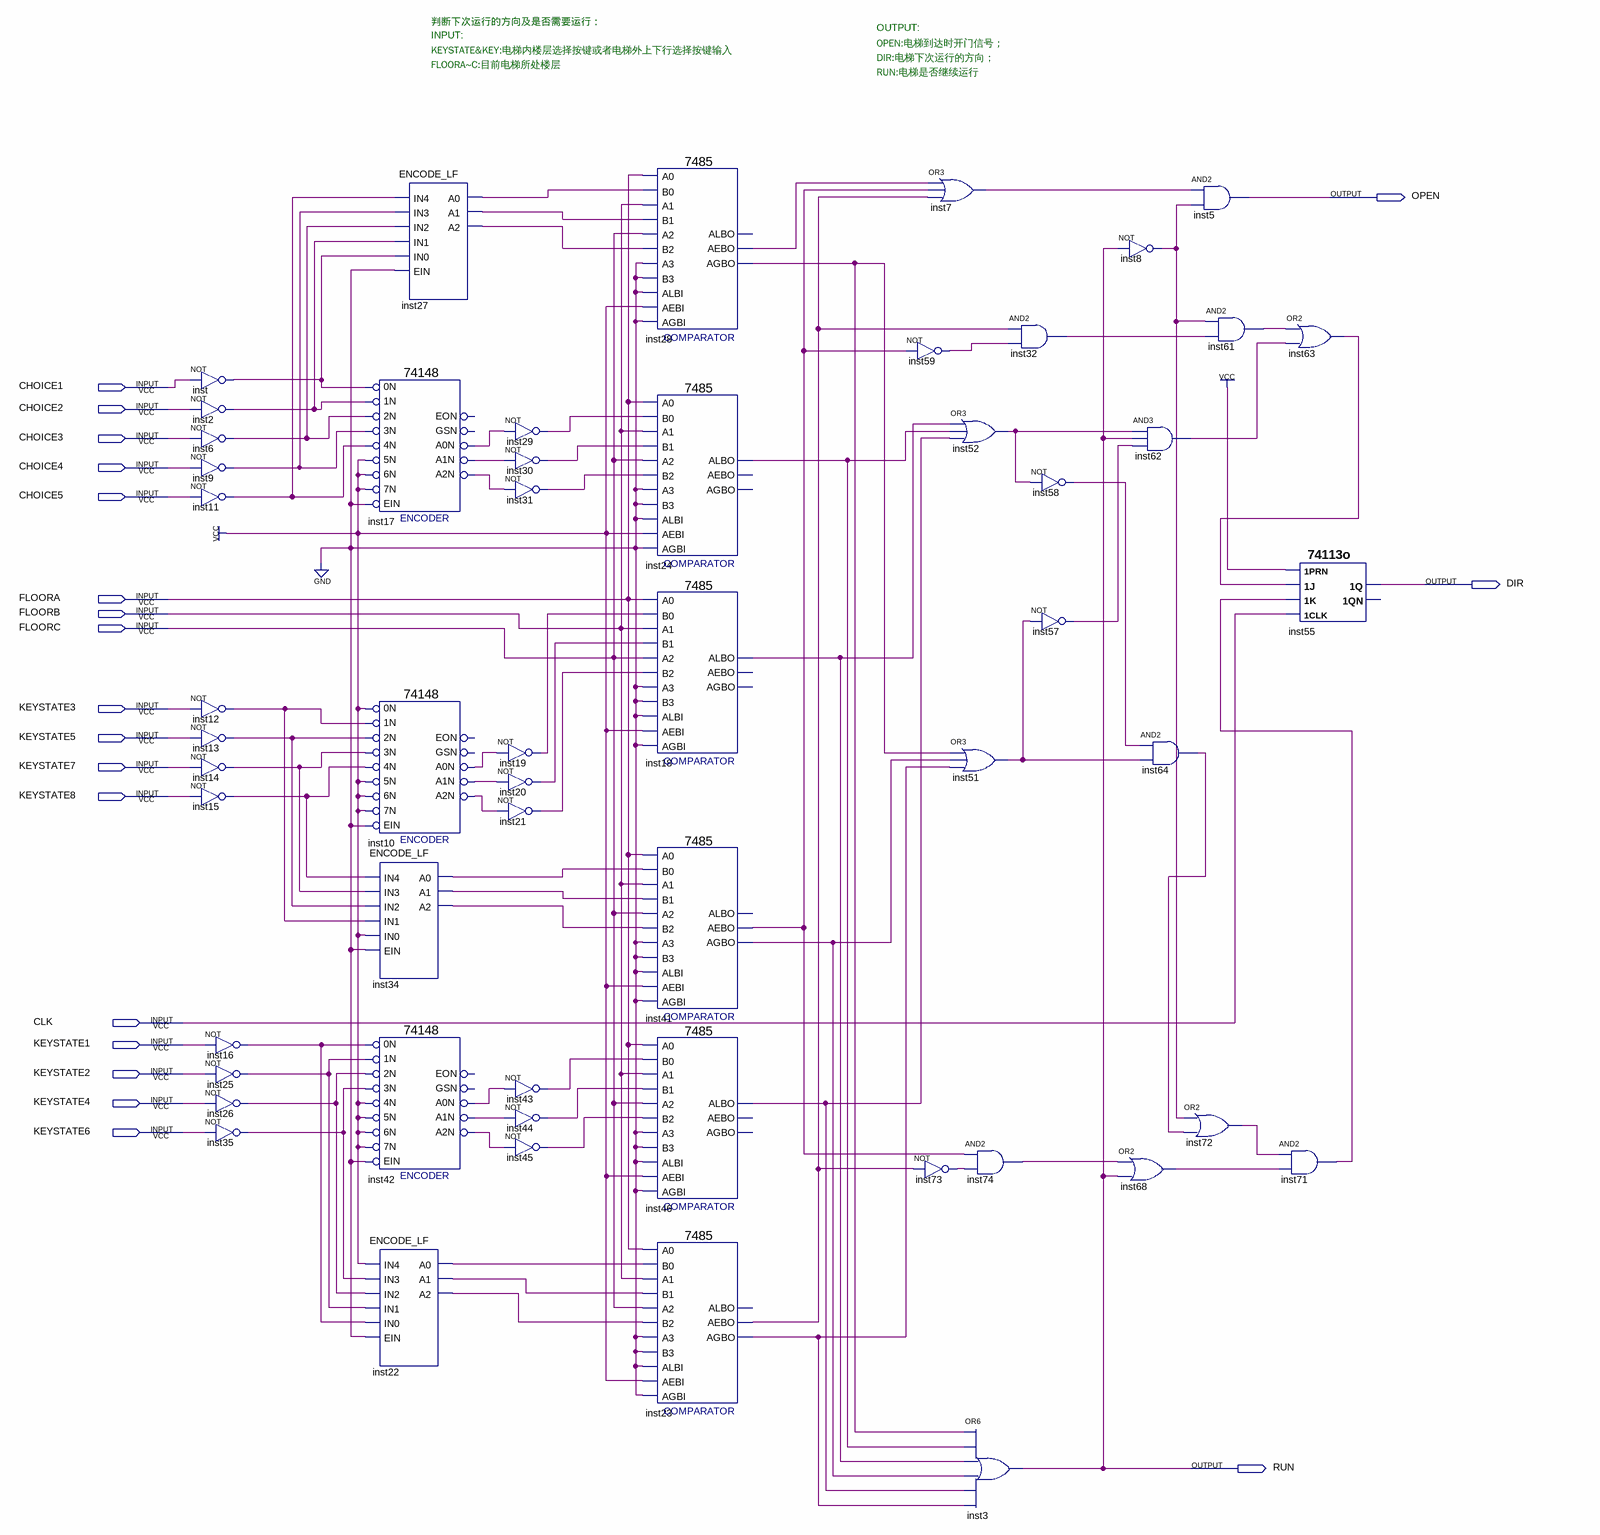
[diagram p0: schematic sheet]
// Quartus schematic nextfloor.bdf as structural Verilog: 54 symbols, 20 pins
module nextfloor (
  input  CHOICE1,
  input  CHOICE2,
  input  CHOICE3,
  input  CHOICE4,
  input  CHOICE5,
  input  FLOORA,
  input  FLOORB,
  input  FLOORC,
  input  KEYSTATE3,
  input  KEYSTATE5,
  input  KEYSTATE7,
  input  KEYSTATE8,
  input  CLK,
  input  KEYSTATE1,
  input  KEYSTATE2,
  input  KEYSTATE4,
  input  KEYSTATE6,
  output OPEN,
  output DIR,
  output RUN
);

  wire inst2_out, inst6_out, inst7_out, inst8_out, inst9_out, inst10_a0n, inst10_a1n, inst10_a2n, inst11_out,
       inst12_out, inst13_out, inst14_out, inst15_out, inst16_out, inst17_a0n, inst17_a1n, inst17_a2n,
       inst18_albo, inst19_out, inst20_out, inst21_out, inst22_a0, inst22_a1, inst22_a2, inst23_aebo,
       inst23_agbo, inst24_albo, inst25_out, inst26_out, inst27_a0, inst27_a1, inst27_a2, inst28_aebo,
       inst28_agbo, inst29_out, inst30_out, inst31_out, inst32_out, inst34_a0, inst34_a1, inst34_a2,
       inst35_out, inst41_aebo, inst41_agbo, inst42_a0n, inst42_a1n, inst42_a2n, inst43_out, inst44_out,
       inst45_out, inst46_albo, inst51_out, inst52_out, inst57_out, inst58_out, inst59_out, inst61_out,
       inst62_out, inst63_out, inst64_out, inst68_out, inst71_out, inst72_out, inst73_out, inst74_out,
       inst_out;

  not inst (inst_out, CHOICE1);
  not inst2 (inst2_out, CHOICE2);
  not inst6 (inst6_out, CHOICE3);
  not inst9 (inst9_out, CHOICE4);
  not inst11 (inst11_out, CHOICE5);
  not inst12 (inst12_out, KEYSTATE3);
  not inst13 (inst13_out, KEYSTATE5);
  not inst14 (inst14_out, KEYSTATE7);
  not inst15 (inst15_out, KEYSTATE8);
  not inst16 (inst16_out, KEYSTATE1);
  not inst25 (inst25_out, KEYSTATE2);
  not inst26 (inst26_out, KEYSTATE4);
  not inst35 (inst35_out, KEYSTATE6);
  ENCODE_LF inst27 (
    .IN4(inst11_out), .IN3(inst9_out), .IN2(inst6_out), .IN1(inst2_out), .IN0(inst_out), .EIN(1'b0),
    .A0(inst27_a0), .A1(inst27_a1), .A2(inst27_a2));
  \74148  inst17 (
    .\5N (1'b1), .\0N (inst_out), .\1N (inst2_out), .\2N (inst6_out), .\3N (inst9_out), .\4N (inst11_out),
    .EIN(1'b0), .\6N (1'b1), .\7N (1'b1), .A1N(inst17_a1n), .A0N(inst17_a0n), .A2N(inst17_a2n));  // open: EON, GSN
  \74148  inst10 (
    .\5N (1'b1), .\0N (1'b1), .\1N (inst12_out), .\2N (inst13_out), .\3N (inst14_out), .\4N (inst15_out),
    .EIN(1'b0), .\6N (1'b1), .\7N (1'b1), .A1N(inst10_a1n), .A0N(inst10_a0n), .A2N(inst10_a2n));  // open: EON, GSN
  ENCODE_LF inst34 (
    .IN4(inst15_out), .IN3(inst14_out), .IN2(inst13_out), .IN1(inst12_out), .IN0(1'b1), .EIN(1'b0),
    .A0(inst34_a0), .A1(inst34_a1), .A2(inst34_a2));
  \74148  inst42 (
    .\5N (1'b1), .\0N (inst16_out), .\1N (inst25_out), .\2N (inst26_out), .\3N (inst35_out), .\4N (1'b1),
    .EIN(1'b0), .\6N (1'b1), .\7N (1'b1), .A1N(inst42_a1n), .A0N(inst42_a0n), .A2N(inst42_a2n));  // open: EON, GSN
  ENCODE_LF inst22 (
    .IN4(1'b1), .IN3(inst35_out), .IN2(inst26_out), .IN1(inst25_out), .IN0(inst16_out), .EIN(1'b0),
    .A0(inst22_a0), .A1(inst22_a1), .A2(inst22_a2));
  not inst29 (inst29_out, inst17_a0n);
  not inst30 (inst30_out, inst17_a1n);
  not inst31 (inst31_out, inst17_a2n);
  not inst19 (inst19_out, inst10_a0n);
  not inst20 (inst20_out, inst10_a1n);
  not inst21 (inst21_out, inst10_a2n);
  not inst43 (inst43_out, inst42_a0n);
  not inst44 (inst44_out, inst42_a1n);
  not inst45 (inst45_out, inst42_a2n);
  \7485  inst28 (
    .A3(1'b0), .B2(inst27_a2), .A2(FLOORC), .AEBI(1'b1), .AGBI(1'b0), .ALBI(1'b0), .A0(FLOORA),
    .B0(inst27_a0), .B3(1'b0), .A1(FLOORB), .B1(inst27_a1), .AGBO(inst28_agbo), .AEBO(inst28_aebo));  // open: ALBO
  \7485  inst24 (
    .A3(1'b0), .B2(inst31_out), .A2(FLOORC), .AEBI(1'b1), .AGBI(1'b0), .ALBI(1'b0), .A0(FLOORA),
    .B0(inst29_out), .B3(1'b0), .A1(FLOORB), .B1(inst30_out), .ALBO(inst24_albo));  // open: AGBO, AEBO
  \7485  inst18 (
    .A3(1'b0), .B2(inst21_out), .A2(FLOORC), .AEBI(1'b1), .AGBI(1'b0), .ALBI(1'b0), .A0(FLOORA),
    .B0(inst19_out), .B3(1'b0), .A1(FLOORB), .B1(inst20_out), .ALBO(inst18_albo));  // open: AGBO, AEBO
  \7485  inst41 (
    .A3(1'b0), .B2(inst34_a2), .A2(FLOORC), .AEBI(1'b1), .AGBI(1'b0), .ALBI(1'b0), .A0(FLOORA),
    .B0(inst34_a0), .B3(1'b0), .A1(FLOORB), .B1(inst34_a1), .AGBO(inst41_agbo), .AEBO(inst41_aebo));  // open: ALBO
  \7485  inst46 (
    .A3(1'b0), .B2(inst45_out), .A2(FLOORC), .AEBI(1'b1), .AGBI(1'b0), .ALBI(1'b0), .A0(FLOORA),
    .B0(inst43_out), .B3(1'b0), .A1(FLOORB), .B1(inst44_out), .ALBO(inst46_albo));  // open: AGBO, AEBO
  \7485  inst23 (
    .A3(1'b0), .B2(inst22_a2), .A2(FLOORC), .AEBI(1'b1), .AGBI(1'b0), .ALBI(1'b0), .A0(FLOORA),
    .B0(inst22_a0), .B3(1'b0), .A1(FLOORB), .B1(inst22_a1), .AGBO(inst23_agbo), .AEBO(inst23_aebo));  // open: ALBO
  or inst7 (inst7_out, inst28_aebo, inst41_aebo, inst23_aebo);
  not inst59 (inst59_out, inst41_aebo);
  not inst73 (inst73_out, inst23_aebo);
  or inst52 (inst52_out, inst18_albo, inst24_albo, inst46_albo);
  or inst51 (inst51_out, inst28_agbo, inst41_agbo, inst23_agbo);
  and inst74 (inst74_out, inst41_aebo, inst73_out);
  or inst3 (RUN, inst28_agbo, inst24_albo, inst18_albo, inst41_agbo, inst46_albo, inst23_agbo);
  and inst32 (inst32_out, inst23_aebo, inst59_out);
  not inst58 (inst58_out, inst52_out);
  not inst57 (inst57_out, inst51_out);
  not inst8 (inst8_out, RUN);
  and inst62 (inst62_out, inst52_out, RUN, inst57_out);
  and inst64 (inst64_out, inst58_out, inst51_out);
  or inst68 (inst68_out, inst74_out, RUN);
  and inst5 (OPEN, inst7_out, inst8_out);
  and inst61 (inst61_out, inst8_out, inst32_out);
  or inst72 (inst72_out, inst8_out, inst64_out);
  and inst71 (inst71_out, inst72_out, inst68_out);
  or inst63 (inst63_out, inst61_out, inst62_out);
  \74113o  inst55 (.\1K (inst71_out), .\1J (inst63_out), .\1CLK (CLK), .\1PRN (1'b1), .\1Q (DIR));  // open: 1QN

  // Notes on the sheet:
  //   判断下次运行的方向及是否需要运行：
  //   OUTPUT:
  //   INPUT:
  //   OPEN:电梯到达时开门信号；
  //   KEYSTATE&KEY:电梯内楼层选择按键或者电梯外上下行选择按键输入
  //   DIR:电梯下次运行的方向；
  //   FLOORA~C:目前电梯所处楼层
  //   RUN:电梯是否继续运行
endmodule
